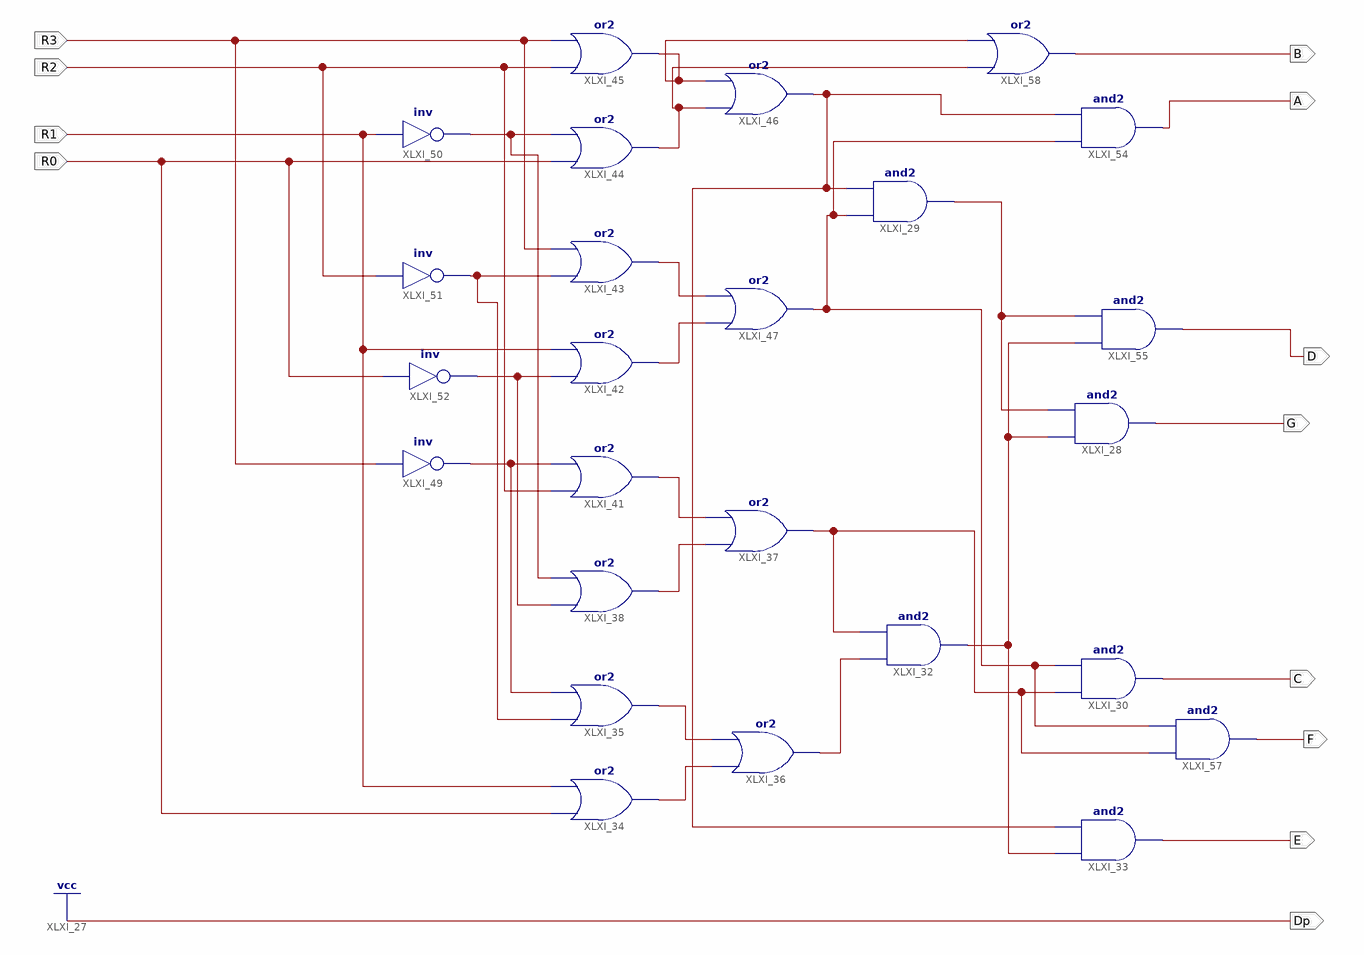
[diagram p0: schematic sheet 1]
// Xilinx ISE schematic ROT_7SEG.sch (virtex6) as structural Verilog: 25 symbols, 12 ports
module ROT_7SEG (
  input  R3,
  input  R2,
  input  R0,
  input  R1,
  output G,
  output C,
  output E,
  output D,
  output F,
  output Dp,
  output A,
  output B
);

  wire XLXN_1, XLXN_3, XLXN_7, XLXN_8, XLXN_9, XLXN_10, XLXN_13, XLXN_15, XLXN_16, XLXN_44, XLXN_47, XLXN_74,
       XLXN_77, XLXN_78, XLXN_90, XLXN_92, XLXN_93, XLXN_95;

  and XLXI_28 (G, XLXN_95, XLXN_44);
  and XLXI_29 (XLXN_44, XLXN_92, XLXN_47);
  and XLXI_30 (C, XLXN_93, XLXN_92);
  and XLXI_32 (XLXN_95, XLXN_13, XLXN_93);
  and XLXI_33 (E, XLXN_95, XLXN_47);
  or XLXI_34 (XLXN_16, R0, R1);
  or XLXI_35 (XLXN_15, XLXN_78, XLXN_77);
  or XLXI_36 (XLXN_13, XLXN_16, XLXN_15);
  or XLXI_37 (XLXN_93, XLXN_10, XLXN_9);
  or XLXI_38 (XLXN_10, XLXN_90, XLXN_74);
  or XLXI_41 (XLXN_9, R2, XLXN_77);
  or XLXI_42 (XLXN_8, XLXN_90, R1);
  or XLXI_43 (XLXN_7, XLXN_78, R3);
  or XLXI_44 (XLXN_3, R0, XLXN_74);
  or XLXI_45 (XLXN_1, R2, R3);
  or XLXI_46 (XLXN_47, XLXN_3, XLXN_1);
  or XLXI_47 (XLXN_92, XLXN_8, XLXN_7);
  not XLXI_49 (XLXN_77, R3);
  not XLXI_50 (XLXN_74, R1);
  not XLXI_51 (XLXN_78, R2);
  not XLXI_52 (XLXN_90, R0);
  and XLXI_54 (A, XLXN_92, XLXN_47);
  and XLXI_55 (D, XLXN_95, XLXN_44);
  and XLXI_57 (F, XLXN_93, XLXN_92);
  or XLXI_58 (B, XLXN_3, XLXN_1);

  assign Dp = 1'b1;
endmodule
